# EAGLE design Adafruit_5x5_NeoPixel_Grid_BFF (EAGLE 9.6.2)
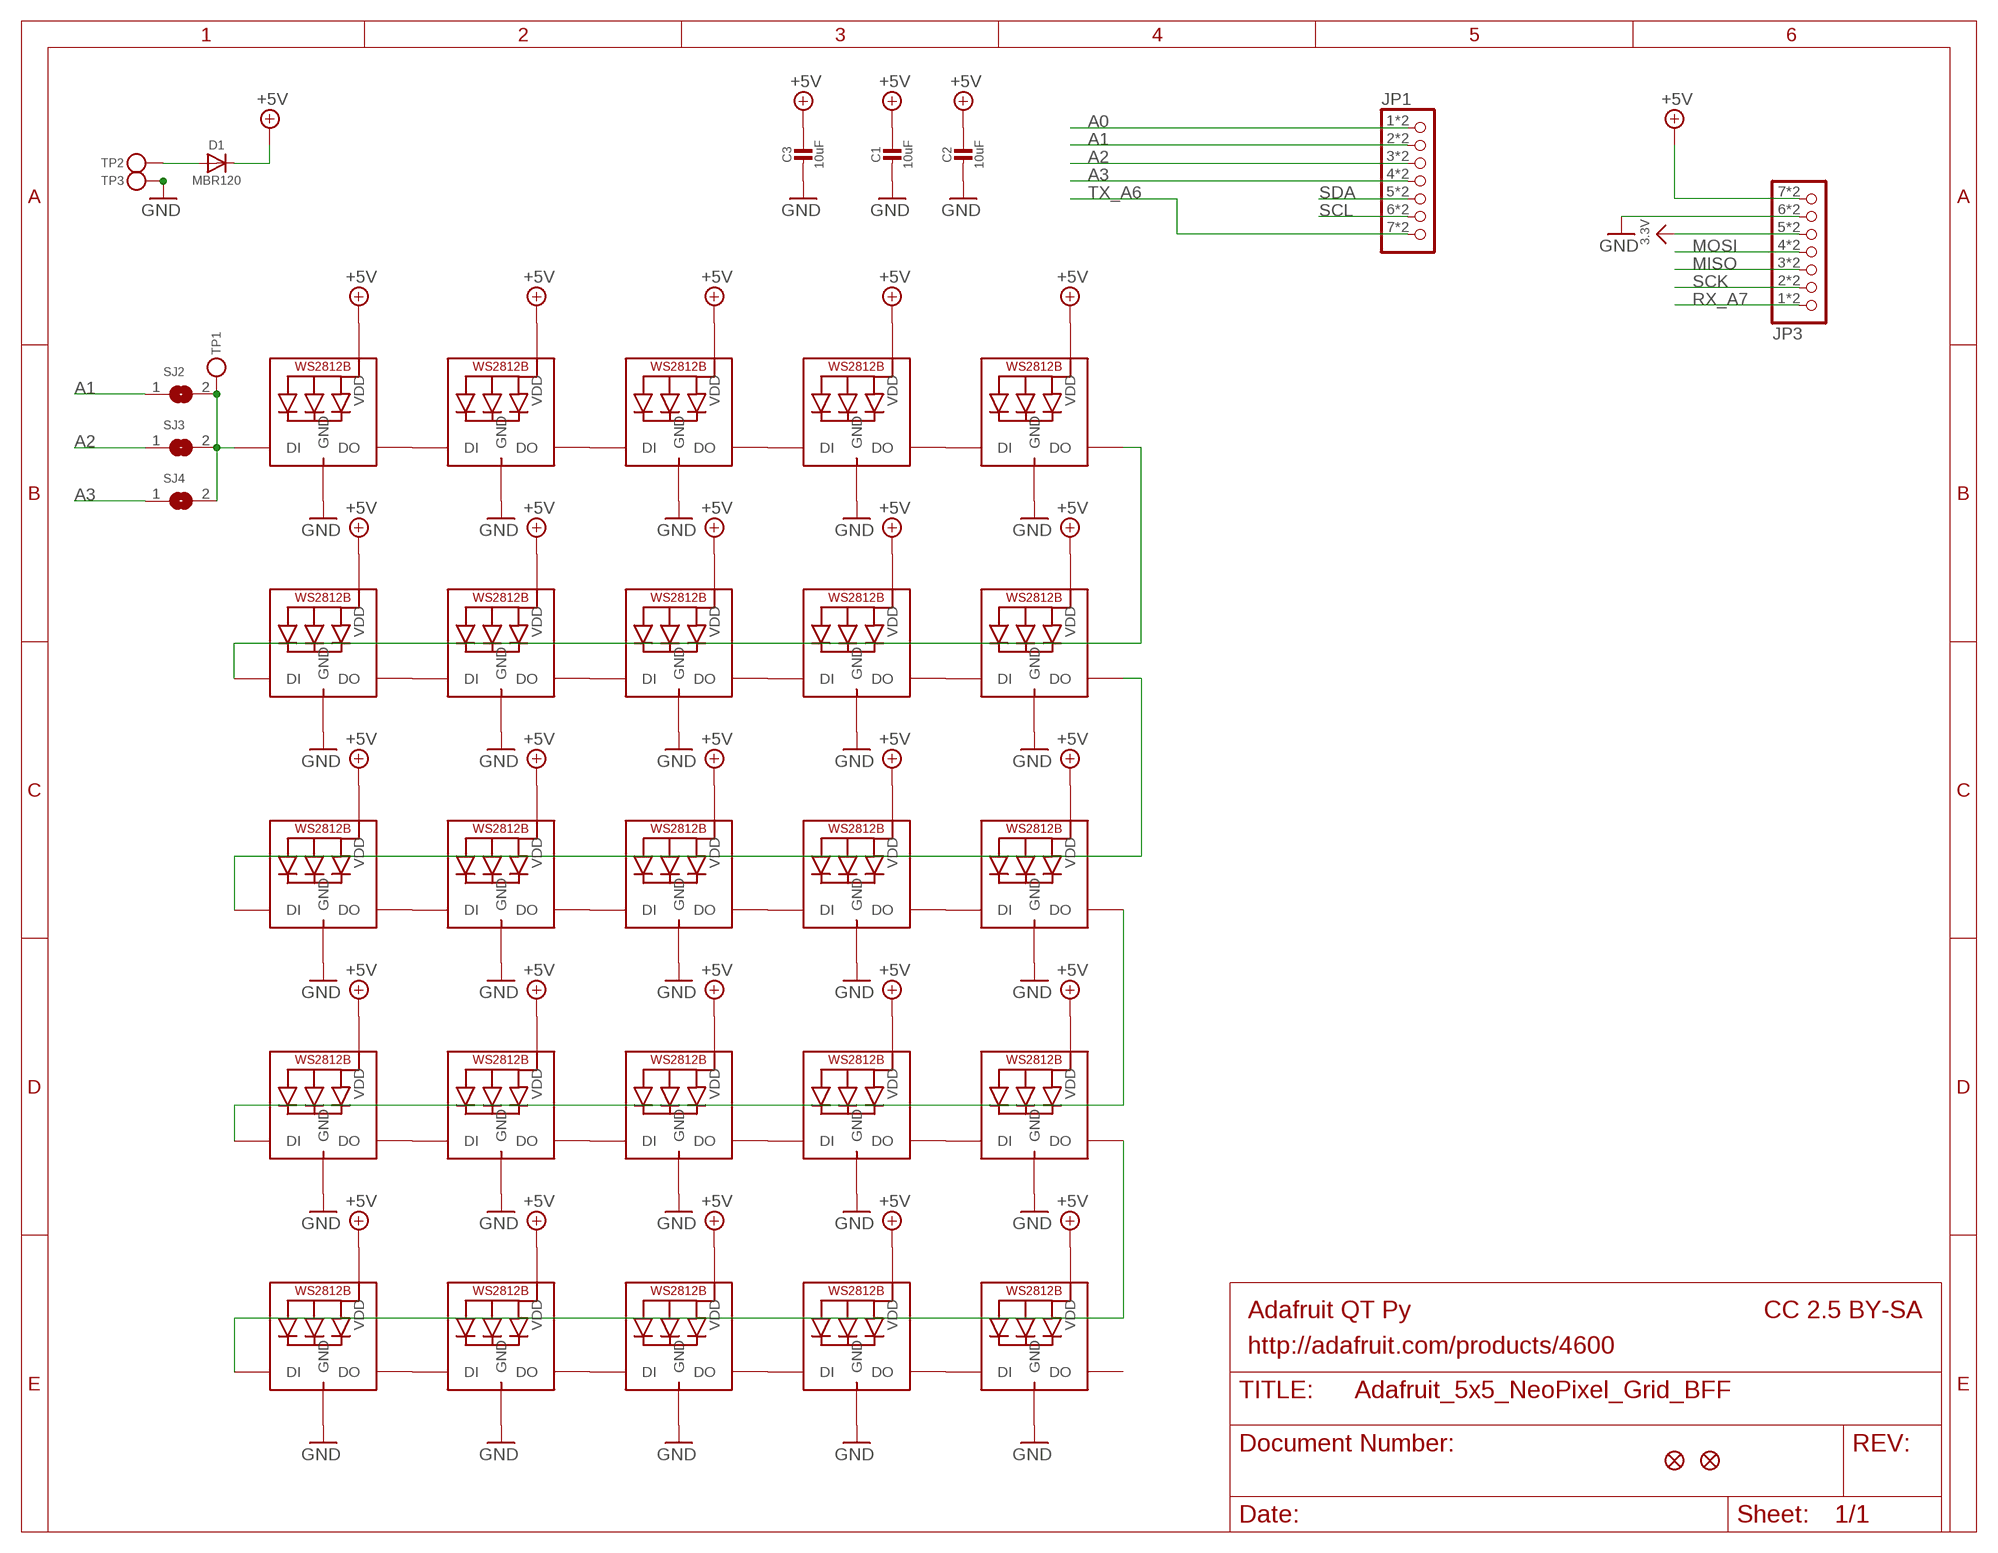
[diagram p0: schematic, sheet 1]

## Parts
C1  10uF  CAP_CERAMIC0603_NO  [0603-NO]
C2  10uF  CAP_CERAMIC0603_NO  [0603-NO]
C3  10uF  CAP_CERAMIC0603_NO  [0603-NO]
D1  MBR120  DIODESOD-123  [SOD-123]
JP1  HEADER-1X7_CASTEL  [1X07_CASTEL]
JP3  HEADER-1X7_CASTEL  [1X07_CASTEL]
LED1  WS2812B_SK6805_1515  [SK6805_1515]
LED2  WS2812B_SK6805_1515  [SK6805_1515]
LED3  WS2812B_SK6805_1515  [SK6805_1515]
LED4  WS2812B_SK6805_1515  [SK6805_1515]
LED5  WS2812B_SK6805_1515  [SK6805_1515]
LED6  WS2812B_SK6805_1515  [SK6805_1515]
LED7  WS2812B_SK6805_1515  [SK6805_1515]
LED8  WS2812B_SK6805_1515  [SK6805_1515]
LED9  WS2812B_SK6805_1515  [SK6805_1515]
LED10  WS2812B_SK6805_1515  [SK6805_1515]
LED11  WS2812B_SK6805_1515  [SK6805_1515]
LED12  WS2812B_SK6805_1515  [SK6805_1515]
LED13  WS2812B_SK6805_1515  [SK6805_1515]
LED14  WS2812B_SK6805_1515  [SK6805_1515]
LED15  WS2812B_SK6805_1515  [SK6805_1515]
LED16  WS2812B_SK6805_1515  [SK6805_1515]
LED17  WS2812B_SK6805_1515  [SK6805_1515]
LED18  WS2812B_SK6805_1515  [SK6805_1515]
LED19  WS2812B_SK6805_1515  [SK6805_1515]
LED20  WS2812B_SK6805_1515  [SK6805_1515]
LED21  WS2812B_SK6805_1515  [SK6805_1515]
LED22  WS2812B_SK6805_1515  [SK6805_1515]
LED23  WS2812B_SK6805_1515  [SK6805_1515]
LED24  WS2812B_SK6805_1515  [SK6805_1515]
LED25  WS2812B_SK6805_1515  [SK6805_1515]
SJ2  SOLDERJUMPER  [SOLDERJUMPER_ARROW_NOPASTE]
SJ3  SOLDERJUMPER  [SOLDERJUMPER_ARROW_NOPASTE]
SJ4  SOLDERJUMPERCLOSED  [SOLDERJUMPER_CLOSEDWIRE]
TP1  TESTPOINT_1X3  [TESTPOINT_RECT_1X3MM]
TP2  TESTPOINT_PLUS13  [TESTPOINT_PLUS_1X3MM]
TP3  TESTPOINT_MINUS  [TESTPOINT_MINUS_1X3MM]
U$6  FIDUCIAL_1MM  [FIDUCIAL_1MM]
U$8  FIDUCIAL_1MM  [FIDUCIAL_1MM]

## Nets
3.3V [power]: JP3.5 JP3.5C
+5V [power]: C1.1 C2.1 C3.1 D1.C JP3.7 JP3.7C LED1.2(VDD) LED2.2(VDD) LED3.2(VDD) LED4.2(VDD) LED5.2(VDD) LED6.2(VDD) LED7.2(VDD) LED8.2(VDD) LED9.2(VDD) LED10.2(VDD) LED11.2(VDD) LED12.2(VDD) LED13.2(VDD) LED14.2(VDD) LED15.2(VDD) LED16.2(VDD) LED17.2(VDD) LED18.2(VDD) LED19.2(VDD) LED20.2(VDD) LED21.2(VDD) LED22.2(VDD) LED23.2(VDD) LED24.2(VDD) LED25.2(VDD)
A0: JP1.1 JP1.1C
A1: JP1.2 JP1.2C SJ2.1
A2: JP1.3 JP1.3C SJ3.1
A3: JP1.4 JP1.4C SJ4.1
GND [power]: C1.2 C2.2 C3.2 JP3.6 JP3.6C LED1.4(GND) LED2.4(GND) LED3.4(GND) LED4.4(GND) LED5.4(GND) LED6.4(GND) LED7.4(GND) LED8.4(GND) LED9.4(GND) LED10.4(GND) LED11.4(GND) LED12.4(GND) LED13.4(GND) LED14.4(GND) LED15.4(GND) LED16.4(GND) LED17.4(GND) LED18.4(GND) LED19.4(GND) LED20.4(GND) LED21.4(GND) LED22.4(GND) LED23.4(GND) LED24.4(GND) LED25.4(GND) TP3.P$1
MISO: JP3.3 JP3.3C
MOSI: JP3.4 JP3.4C
N$1: LED1.3(DO) LED2.1(DI)
N$2: LED2.3(DO) LED3.1(DI)
N$3: LED3.3(DO) LED4.1(DI)
N$4: LED4.3(DO) LED5.1(DI)
N$5: LED6.3(DO) LED7.1(DI)
N$6: LED7.3(DO) LED8.1(DI)
N$7: LED8.3(DO) LED9.1(DI)
N$8: LED9.3(DO) LED10.1(DI)
N$9: LED11.3(DO) LED12.1(DI)
N$10: LED12.3(DO) LED13.1(DI)
N$11: LED13.3(DO) LED14.1(DI)
N$12: LED14.3(DO) LED15.1(DI)
N$13: LED16.3(DO) LED17.1(DI)
N$14: LED17.3(DO) LED18.1(DI)
N$15: LED18.3(DO) LED19.1(DI)
N$16: LED19.3(DO) LED20.1(DI)
N$17: LED21.3(DO) LED22.1(DI)
N$18: LED22.3(DO) LED23.1(DI)
N$19: LED23.3(DO) LED24.1(DI)
N$20: LED24.3(DO) LED25.1(DI)
N$21: LED5.3(DO) LED6.1(DI)
N$22: LED10.3(DO) LED11.1(DI)
N$23: LED15.3(DO) LED16.1(DI)
N$24: LED20.3(DO) LED21.1(DI)
N$25: LED1.1(DI) SJ2.2 SJ3.2 SJ4.2 TP1.P$1
N$26: D1.A TP2.P$1
RX_A7: JP3.1 JP3.1C
SCK: JP3.2 JP3.2C
SCL: JP1.6 JP1.6C
SDA: JP1.5 JP1.5C
TX_A6: JP1.7 JP1.7C
Unconnected: LED25.3(DO)

## Notes on the sheet
- Adafruit QT Py | CC 2.5 BY-SA
- http://adafruit.com/products/4600

## Library data of the parts
C1-C3 = microbuilder:CAP_CERAMIC: Ceramic Capacitors For new designs, use the packages preceded by an '_' character since they are more reliable: The following footprints should be used on most boards: _0402 - Standard footprint for regular board layouts _0603 - Standard footprint for regular board layouts _0805 - Standard footprint for regular board layouts _1206 - Standard footprint for regular board layouts For extremely tight-pitch boards where space is at a premium, the following 'micro-pitch' footprints can be used (smaller pads, no silkscreen outline, etc.): _0402MP - Micro-pitch footprint for very dense/compact boards _0603MP - Micro-pitch footprint for very dense/compact boards _0805MP - Micro-pitch footprint for very dense/compact boards _1206MP - Micro-pitch footprint for very dense/compact boards
D1 = microbuilder:DIODE: Diode SMA Model Volts Amps Type Vf Ir Digikey # Notes SSA34-E3 40V 3A Schottky 480mV @ 3A 200uA @ 40V SSA34-E3/61TGITR-ND CDBA120-G 20V 1A Schottky 500mV @ 1A 500uA @ 20V 641-1014-6-ND REEL MBRA210 10V 2A Schottky 350mV @ 2A 700uA @ 10V MBRA210LT3 SOD-123 Model Volts Amps Type Vf Ir Order # Notes BAT54T1G 30V 200mA Schottky 800mV @ 200mA 2uA @ 25V BAT54T1GOSTR-ND B0530W 30V 500mA Schottky 430mV @ 500mA 130uA @ 30V B0530W-FDICT-ND REEL MBR120 20V 1A Schottky 340mV @ 1A MBR120VLSFT1GOSCT-ND SOD-323 Model Volts Amps Type Vf Ir Order # Notes PMEG2005EJ 20V 500mA Schottky 355mV @ 500mA 568-4110-1-ND ZLLS410 10V 570mA Schottky 380mV @ 570mA ZLLS410CT-ND 1N4148WS 75V 150mA Silicon/Simple 1V 1N4148WSFSCT-ND REEL SOD-523 Model Volts Amps Type Vf Ir Order # Notes BAT54XV2 30V 200mA Schottky 0.8V @ 100mA BAT54XV2CT-ND TB751S 30V 30mA Schottky RB751S-40TE61CT-ND SOT23-R/W (R = Solder Paste/Reflow Ovens, W = Hand-Soldering) Model Volts Amps Type Vf Ir Order # Notes BAT54FILM 40V 300mA Schottky 497-7162-1-ND POWERDI-5 Model Volts Amps Type Vf Ir Order # Notes PDS560 60V 5A Schottky 670mV @ 5A 150uA @ 60V PDS560DICT-ND
JP1 JP3 = adafruit_electromech:HEADER-1X7: PIN HEADER
LED1-LED25 = microbuilder:WS2812B; LCSC: C2890035
SJ2 SJ3 = microbuilder:SOLDERJUMPER: SMD Solder JUMPER Solder the two pads together to create a connection, or remove the solder to break it. REFLOW - Use this footprint for solder paste and reflow ovens. WAVE - Use this footprint for hand-soldering (larger pads). CLOSED - Has a trace between the two pads to ensure it is closed by default. The trace needs to be cut to disable the jumper, and can be closed again by creating a solder bridge between the two pads.; BOM: EXCLUDE
SJ4 = microbuilder:SOLDERJUMPER: SMD Solder JUMPER Solder the two pads together to create a connection, or remove the solder to break it. REFLOW - Use this footprint for solder paste and reflow ovens. WAVE - Use this footprint for hand-soldering (larger pads). CLOSED - Has a trace between the two pads to ensure it is closed by default. The trace needs to be cut to disable the jumper, and can be closed again by creating a solder bridge between the two pads.
TP1-TP3 = microbuilder:TESTPOINT: Test Point Various test points for characterisation and PCB testing TESTPOINT_SMT - Compact Surface Mount Test Point [Digikey: 5016KTR-ND]
U$6 U$8 = microbuilder:FIDUCIAL: Fiducial Alignment Points Various fiducial points for machine vision alignment.; BOM: EXCLUDE

## Net classes
1 power: width 0.254 mm
2 gnd: width 0.254 mm

## Board
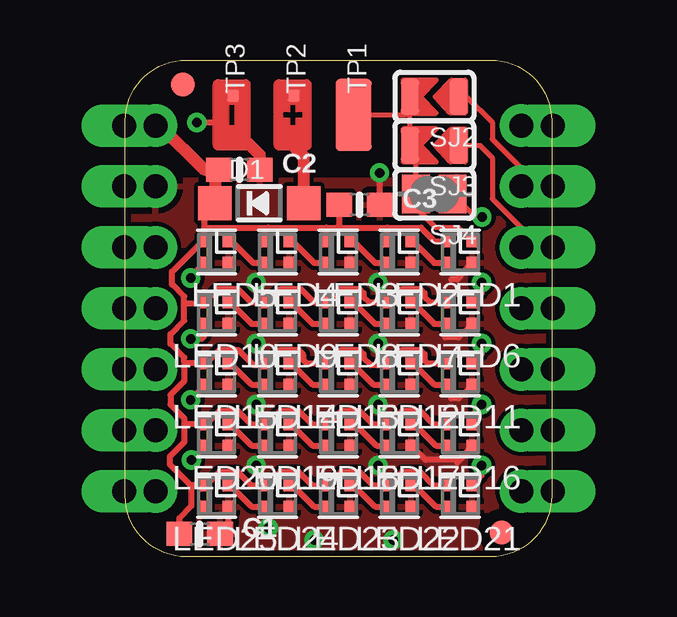
[diagram p1: board, top side]
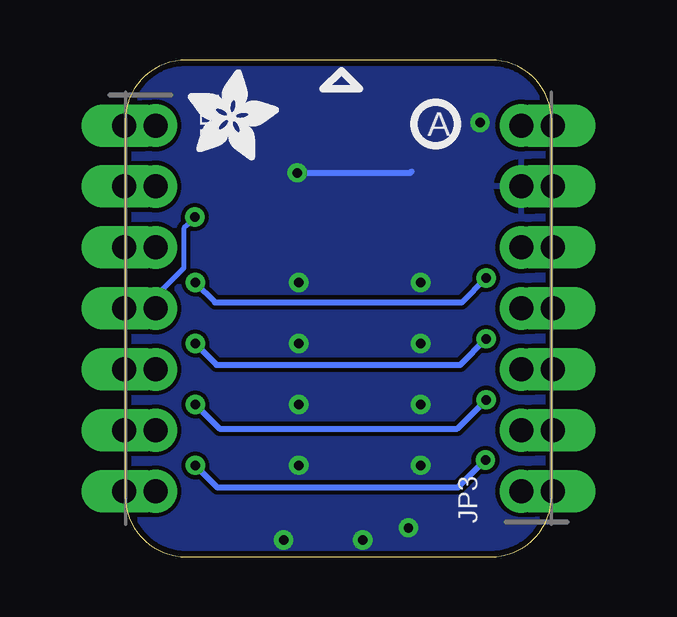
[diagram p2: board, bottom side, seen from below]

Size 17.78 x 20.7 mm. Coordinates in mm from the lower left corner, seen from the top.
Outline: 17.78,18.16 17.78,2.54 arc-90 15.24,0 2.54,0 arc-90 0,2.54 0,18.16 arc-90 2.54,20.7 15.24,20.7 arc-90 17.78,18.16
Copper layers (1*16): Top 0.035mm / dielectric 1.5mm / Bottom 0.035mm
Design rules "adafruit 7-7": minimum track width 7mil, minimum drill 15.5mil, track to track 7mil, track to pad 7mil, pad to pad 7mil, via to via 7mil, smd to smd 7mil, copper to edge 10mil, drill to drill 8mil, minimum pad ring 7mil, minimum via ring 8mil, stop-mask expansion 2mil, vias tented up to drill 20mil, thermal gap 10mil

### Footprints (pad centres in the part's own frame; a part is rotated, then mirrored left to right if it is on the bottom)
0603-NO = smd 1.075 x 1: 1 -0.85,0; 2 0.85,0
SOD-123 = smd 1.4 x 1.4: A 1.85,0; C -1.85,0
1X07_CASTEL = drill 1 pad 1.778: 1 -7.62,0; 2 -5.08,0; 3 -2.54,0; 4 0,0; 5 2.54,0; 6 5.08,0; 7 7.62,0 | drill 1 pad 1.778 long: 1C -7.62,-1.324; 2C -5.08,-1.324; 3C -2.54,-1.324; 4C 0,-1.324; 5C 2.54,-1.324; 6C 5.08,-1.324; 7C 7.62,-1.324
SK6805_1515 = smd 0.5 x 0.5: 1 -0.5,-0.45; 2 0.5,-0.45; 3 0.5,0.45; 4 -0.5,0.45
SOLDERJUMPER_ARROW_NOPASTE = smd 0.762 x 1.524: 1 -1.016,0; 2 1.016,0
SOLDERJUMPER_CLOSEDWIRE = smd 1.168 x 1.6: 1 -0.762,0; 2 0.762,0 | smd 0.635 x 0.203: WIRE 0,0
TESTPOINT_RECT_1X3MM = smd 3 x 1.5: P$1 0,0
TESTPOINT_PLUS_1X3MM = smd 0.5 x 0.5: P$1 0.8,-0.05
TESTPOINT_MINUS_1X3MM = smd 0.5 x 0.5: P$1 0.8,-0.05
FIDUCIAL_1MM = smd 1 x 1: 1 0,0

### Placement (x,y rotation side)
C1  3.11,0.95 0 top
C2  4.76,16.13 0 top
C3  9.78,14.67 0 top
D1  5.59,14.73 0 top
E$1  [PCBFEAT-REV-040]  4.83,18.03 0 bottom
E$3  [ADAFRUIT_3.5MM]  15.18,16.51 0 bottom
JP1  16.51,10.35 270 bottom
JP3  1.27,10.35 90 bottom
LED1  13.97,12.7 180 top
LED2  11.43,12.7 180 top
LED3  8.89,12.7 180 top
LED4  6.35,12.7 180 top
LED5  3.81,12.7 180 top
LED6  13.97,10.16 180 top
LED7  11.43,10.16 180 top
LED8  8.89,10.16 180 top
LED9  6.35,10.16 180 top
LED10  3.81,10.16 180 top
LED11  13.97,7.62 180 top
LED12  11.43,7.62 180 top
LED13  8.89,7.62 180 top
LED14  6.35,7.62 180 top
LED15  3.81,7.62 180 top
LED16  13.97,5.08 180 top
LED17  11.43,5.08 180 top
LED18  8.89,5.08 180 top
LED19  6.35,5.08 180 top
LED20  3.81,5.08 180 top
LED21  13.97,2.54 180 top
LED22  11.43,2.54 180 top
LED23  8.89,2.54 180 top
LED24  6.35,2.54 180 top
LED25  3.81,2.54 180 top
PLABEL0  [PLABEL0]  15.56,14.48 90 top
PLABEL2  [PLABEL2]  9.4,16.19 90 top
PLABEL3  [PLABEL3]  9.59,0.89 0 top
PLABEL4  [PLABEL4]  15.24,19.49 90 top
PLABEL5  [PLABEL5]  15.11,17.27 90 top
PLABEL7  [PLABEL7]  8.83,17.78 0 bottom
PLABEL8  [PLABEL8]  8.83,10.35 0 bottom
SJ2  12.89,19.18 180 top
SJ3  12.89,17.14 180 top
SJ4  12.89,15.11 180 top
TP1  9.53,18.41 90 top
TP2  6.99,18.41 90 top
TP3  4.45,18.41 90 top
U$6  15.7,1.02 0 top
U$8  2.41,19.68 0 top

### Tracks (layer width: path | path; a pad name or v marks a point on that pad's centre or on a via)
3.3V
  Top 0.254: JP3.5C JP3.5
+5V
  Top 0.254: 3.31,13.72 LED5.2 3.22,13.15 1.96,11.89 1.96,11.35 2.46,10.85 2.46,10.54 | 3.31,13.72 3.31,14.73 D1.C | JP3.7C 1.46,17.97 | LED4.2 5.85,13.6 5.97,13.72 | 5.97,13.72 8.38,13.72 | 8.38,13.72 8.83,13.72 | 8.83,13.72 10.92,13.72 | 10.92,13.72 12.33,13.72 12.9,13.15 LED1.2 | LED2.2 10.93,13.71 10.92,13.72 | LED3.2 8.39,13.71 8.38,13.72 | 2.75,2.99 2.73,2.99 1.86,3.85 1.86,4.17 2.46,4.78 2.46,5.52 | 3.31,13.72 5.97,13.72 | 2.5,8.07 2.46,8.04 2.46,7.32 1.89,6.74 1.89,6.34 2.46,5.76 2.46,5.52 | 2.5,8.07 2.46,8.1 2.46,8.3 1.89,8.88 1.89,9.28 2.46,9.86 2.46,10.54 | LED6.2 12.7,10.6 12.48,10.82 12.48,10.99 12.31,11.16 11.55,11.16 11,10.61 LED7.2 10.15,10.61 9.95,10.82 9.95,10.99 9.77,11.16 8.95,11.16 LED8.2 7.87,10.6 7.31,11.16 6.47,11.16 5.92,10.61 LED9.2 5.24,10.61 4.69,11.16 3.87,11.16 LED10.2 3.24,10.54 2.46,10.54 | LED21.2 12.86,2.99 12.31,3.54 11.55,3.54 11,2.99 LED22.2 10.32,2.99 9.77,3.54 9.01,3.54 8.46,2.99 LED23.2 7.78,2.99 7.23,3.54 6.47,3.54 5.92,2.99 LED24.2 5.24,2.99 4.69,3.54 3.93,3.54 3.38,2.99 LED25.2 2.75,2.99 | LED16.2 12.86,5.53 12.31,6.08 11.55,6.08 11,5.53 LED17.2 10.32,5.53 9.77,6.08 9.01,6.08 8.46,5.53 LED18.2 7.78,5.53 7.23,6.08 6.47,6.08 5.92,5.53 LED19.2 5.24,5.53 4.69,6.08 3.93,6.08 3.38,5.53 LED20.2 2.47,5.53 2.46,5.52 | LED11.2 12.6,8.07 12.48,8.19 12.48,8.45 12.31,8.62 11.55,8.62 11,8.07 LED12.2 10.86,8 10.22,8 9.95,8.28 9.95,8.45 9.77,8.62 9.01,8.62 8.46,8.07 LED13.2 7.56,8.06 7.41,8.22 7.41,8.45 7.23,8.62 6.47,8.62 5.92,8.07 LED14.2 5.78,8 5.33,8 4.71,8.62 3.93,8.62 3.38,8.07 LED15.2 2.5,8.07 | 2.75,2.99 2.75,2.12 2.26,1.63 C1.1
  Top 0.254: 8.83,13.72 8.93,13.82 C3.1
  Top 0.508: JP3.7 1.46,17.97 3.3,16.13 C2.1 3.74,15.95 D1.C
A0
  Top 0.254: JP1.1C JP1.1
A1
  Top 0.203: SJ2.1 14.22,19.18 15.3,18.1 15.3,17.4 16.51,16.19 JP1.2
  Top 0.254: JP1.2C JP1.2
A2
  Top 0.203: SJ3.1 14.8,17.14 15.3,16.64 15.3,14.92 16.51,13.72 JP1.3
  Top 0.254: JP1.3C JP1.3
A3  (via drill 0.39)
  Top 0.203: v14.88,14.16 14.61,14.16 SJ4.1
  Top 0.254: JP1.4C JP1.4
  Bottom 0.203: v14.88,14.16 15.19,13.85 15.19,13.84 15.34,13.69 15.34,12.03 16.51,10.86 JP1.4
GND  (via drill 0.39)
  Top 0.254: JP3.6C JP3.6 | 13.84,3.94 14.47,4.56 LED16.4 13.88,4.04 12.52,4.04 LED17.4 | 13.59,6.6 13.9,6.6 LED11.4 | LED6.4 13.9,9.14 13.34,9.14 | LED1.4 13.97,11.75 13.97,11.68 13.84,11.56 13.59,11.56 | v2.98,18.1 3.75,18.1 3.87,18.22 3.87,19.1 3.99,19.21 TP3.P$1 | C3.2 10.63,15.98 v10.6,16 | C1.2 4.31,1.3 LED25.4
  Top 0.508: C2.2 5.61,16.74 4.89,17.46 4.89,18.83 4.67,19.06 4.65,19.06 TP3.P$1
  Bottom 0.254: v10.6,16 5.91,16 5.84,16.07
  other vias: 5.97,1.21 7.87,0.7 11.18,0.7 10.54,11.43 5.46,11.43 5.46,8.89 10.54,8.89 10.54,6.35 5.46,6.35 5.46,3.81 10.54,3.81
  pour Top: 0,15.68 17.78,15.68 17.78,0 0,0
  pour Bottom: 0.13,20.7 17.78,20.7 17.78,0 0.13,0
MISO
  Top 0.254: JP3.3C JP3.3
MOSI
  Top 0.254: JP3.4C JP3.4
N$1
  Top 0.254: LED2.1 11.99,13.15 12.89,12.25 LED1.3
N$2
  Top 0.254: LED3.1 9.52,13.15 10.42,12.25 LED2.3
N$3
  Top 0.254: LED4.1 6.98,13.15 7.88,12.25 LED3.3
N$4
  Top 0.254: LED5.1 4.44,13.15 5.34,12.25 LED4.3
N$5
  Top 0.254: LED7.1 11.99,10.61 12.89,9.71 LED6.3
N$6
  Top 0.254: LED8.1 9.52,10.61 10.42,9.71 LED7.3
N$7
  Top 0.254: LED9.1 6.91,10.61 7.81,9.71 LED8.3
N$8
  Top 0.254: LED10.1 4.37,10.61 5.27,9.71 LED9.3
N$9
  Top 0.254: LED12.1 11.99,8.07 12.89,7.17 LED11.3
N$10
  Top 0.254: LED13.1 9.45,8.07 10.35,7.17 LED12.3
N$11
  Top 0.254: LED14.1 6.91,8.07 7.81,7.17 LED13.3
N$12
  Top 0.254: LED15.1 4.37,8.07 5.27,7.17 LED14.3
N$13
  Top 0.254: LED17.1 12.06,5.53 12.96,4.63 LED16.3
N$14
  Top 0.254: LED18.1 9.58,5.53 10.48,4.63 LED17.3
N$15
  Top 0.254: LED19.1 6.91,5.53 7.81,4.63 LED18.3
N$16
  Top 0.254: LED20.1 4.37,5.53 5.27,4.63 LED19.3
N$17
  Top 0.254: LED22.1 12.06,2.99 12.96,2.09 LED21.3
N$18
  Top 0.254: LED23.1 9.52,2.99 10.42,2.09 LED22.3
N$19
  Top 0.254: LED24.1 6.98,2.99 7.88,2.09 LED23.3
N$20
  Top 0.254: LED25.1 4.37,2.99 5.27,2.09 LED24.3
N$21  (via drill 0.39)
  Top 0.254: LED5.3 2.73,11.67 v2.73,11.62 | v14.86,11.43 14.86,11 LED6.1
  Bottom 0.254: v14.86,11.43 14.03,10.6 3.75,10.6 v2.73,11.62
N$22  (via drill 0.39)
  Top 0.254: LED10.3 3.31,9.22 3.17,9.08 v2.73,9.08 | v14.86,8.89 14.86,8.46 LED11.1
  Bottom 0.254: v14.86,8.89 13.97,8 3.81,8 v2.73,9.08
N$23  (via drill 0.39)
  Top 0.254: LED15.3 3.31,7.13 v2.73,6.54 | v14.86,6.35 14.61,6.1 14.61,5.67 LED16.1
  Bottom 0.254: v14.86,6.35 13.85,5.34 3.93,5.34 v2.73,6.54
N$24  (via drill 0.39)
  Top 0.254: v14.86,3.81 14.86,3.38 LED21.1 | LED20.3 3.31,4.59 v2.76,4.04
  Bottom 0.254: v14.86,3.81 13.94,2.89 3.9,2.89 v2.76,4.04
N$25
  Top 0.203: LED1.1 13.9,13.72 12.95,13.72 11.87,14.8 SJ4.2 12.13,16.89 SJ3.2 11.87,18.61 | 11.87,18.61 SJ2.2 | TP1.P$1 11.68,18.41 11.87,18.61
N$26
  Top 0.254: TP2.P$1 7.61,18.64 7.61,18.26 6.74,17.4
  Top 0.508: D1.A 7.44,16.7 6.74,17.4
RX_A7
  Top 0.254: JP3.1C JP3.1
SCK
  Top 0.254: JP3.2C JP3.2
SCL
  Top 0.254: JP1.6C JP1.6
SDA
  Top 0.254: JP1.5C JP1.5
TX_A6
  Top 0.254: JP1.7C JP1.7

### Text on the board
Pinguin_tBackup: A1 | A2 | - | + | In | A3 | A3 | 5x5 NeoBFF
Pinguin_bBackup: USB | NeoPixel 5x5 / LED Grid for / QT Py. Solder / back to back / Select data out / on A1/A2/A3